# Altium schematic sheet ESC_and_USB.SchDoc
size A; SheetNumber: 5; SheetTotal: 7
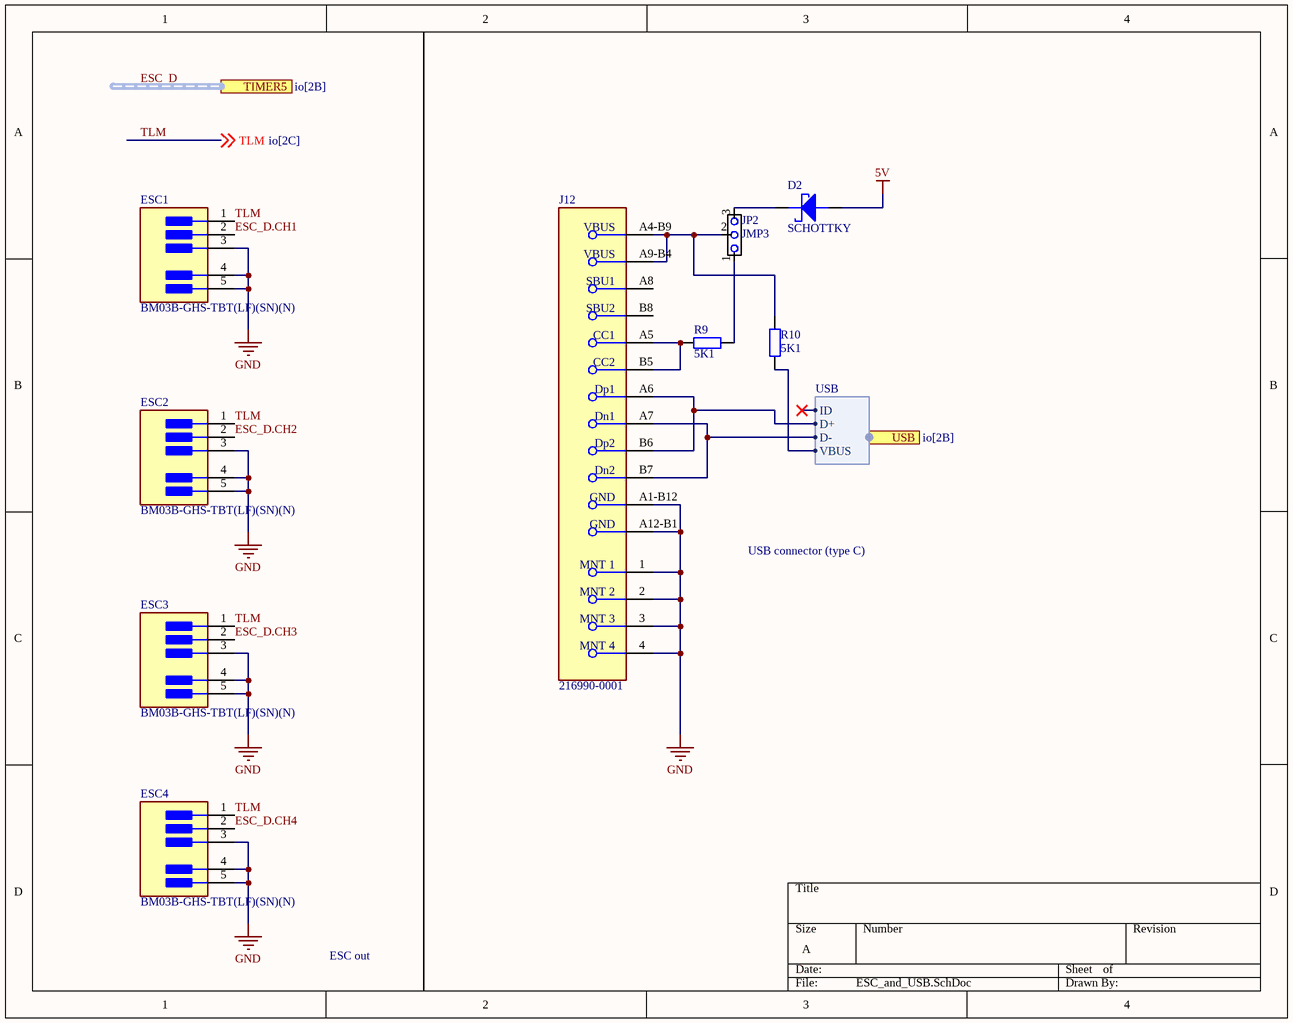
[diagram p0: ESC_and_USB.SchDoc]

## Parts
D2  SCHOTTKY  [FP_SMA]
ESC1  BM03B-GHS-TBT(LF)(SN)(N)  [FP-SM03B-GHS-TB_LF_SN-MFG]
ESC2  BM03B-GHS-TBT(LF)(SN)(N)  [FP-SM03B-GHS-TB_LF_SN-MFG]
ESC3  BM03B-GHS-TBT(LF)(SN)(N)  [FP-SM03B-GHS-TB_LF_SN-MFG]
ESC4  BM03B-GHS-TBT(LF)(SN)(N)  [FP-SM03B-GHS-TB_LF_SN-MFG]
J12  216990-0001  [USBC-FP-216990-0001-MFG]
JP2  JMP3  [JMP3]
R9  5K1  [FP_0805_RES]
R10  5K1  [FP_0805_RES]

## Ports
TIMER5 (harness TIMER, see io[2B]), USB (harness USB, see io[2B])

## Harnesses
USB: ID, D+, D-, VBUS

## Nets
5V: D2.1(ANODE)
GND: ESC1.3 ESC1.4(MNT_1) ESC1.5(MNT_2) ESC2.3 ESC2.4(MNT_1) ESC2.5(MNT_2) ESC3.3 ESC3.4(MNT_1) ESC3.5(MNT_2) ESC4.3 ESC4.4(MNT_1) ESC4.5(MNT_2) J12.1(MNT_1) J12.2(MNT_2) J12.3(MNT_3) J12.4(MNT_4) J12.A1-B12(GND) J12.A12-B1(GND)
ESC_D.CH1: ESC1.2
ESC_D.CH2: ESC2.2
ESC_D.CH3: ESC3.2
ESC_D.CH4: ESC4.2
TLM: ESC1.1 ESC2.1 ESC3.1 ESC4.1 ; off-sheet TLM
NetD2_2: D2.2(CATHODE) JP2.3
NetJ12_A4-B9: J12.A4-B9(VBUS) J12.A9-B4(VBUS) JP2.2 R10.2
NetJ12_A5: J12.A5(CC1) J12.B5(CC2) R9.1
NetJ12_A6: J12.A6(Dp1) J12.B6(Dp2) ; port USB.D+
NetJ12_A7: J12.A7(Dn1) J12.B7(Dn2) ; port USB.D-
NetJP2_1: JP2.1 R9.2
NetR10_1: R10.1 ; port USB.VBUS

Not connected (* = marked no-connect by the designer): J12 A8(SBU1) B8(SBU2)

## Buses and harness runs
harness ESC_D = port TIMER5

## Notes on the sheet
- USB connector (type C)
- ESC out

## Library data of the parts
D2 = SCHOTTKY: Schottky diode
ESC1-ESC4 = CMP-17439-000058-1: 3p; Pitch: 0.049inch; Number of Positions: 3; Connector Type: Header; Contact Finish - Mating: TIN; Lead Free: Lead Free; Series: GH; Fastening Type: Ramp; Number of Rows: 1; Insulation Color: Natural; Contact Material: Bronze; Insulation Material: Nylon; Min Operating Temperature: -25°C; Contact Type: Outer Shroud Contact; Max Operating Temperature: 85°C; Termination: Solder; Flammability Rating: UL94 V-0; Color: Natural; Contact Plating: Tin; Contact Shape: Rectangular; Mount: Surface Mount; Packaging: Cut Tape
J12 = CMP-04767-000014-1: CONN RCP USB2.0 TYP C 24P SMD RA
R9 R10 = RES: Resistor; Value: 5K1